# EAGLE schematic Motor Ouptut (EAGLE 6.5.0)
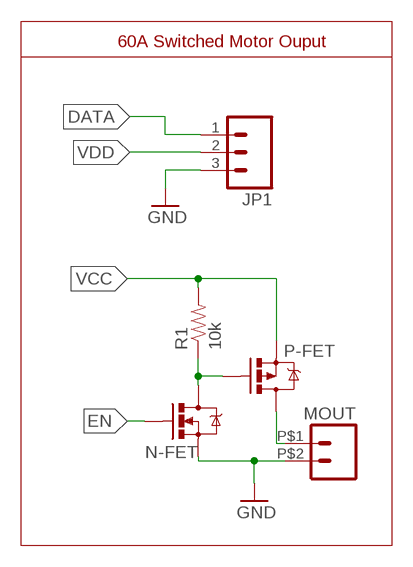
[diagram p0: schematic, sheet 1]

## Parts
JP1  M03PTH  [1X03]
MOUT  MINI_FIT_JR_5569  [MINI_FIT_JR]
N-FET  MOSFET-NCHANNELBSS138  [SOT23]
P-FET  MOSFET_P-CHANNEL  [POWERPAK_SO-8_SINGLE]
R1  10k  RESISTOR0603-RES  [0603-RES]

## Nets
DATA: JP1.1
EN: N-FET.1(G)
GND: JP1.3
N$1: MOUT.P$1 P-FET.P$5(D) P-FET.P$6(D) P-FET.P$7(D) P-FET.P$8(D)
N$2: N-FET.3(D) P-FET.P$4(G) R1.1
N$3: MOUT.P$2 N-FET.2(S)
VCC: P-FET.P$1(S) P-FET.P$2(S) P-FET.P$3(S) R1.2
VDD: JP1.2

## Notes on the sheet
- 60A Switched Motor Ouput

## Library data of the parts
JP1 = SparkFun-Connectors:M03: Header 3 Standard 3-pin 0.1" header. Use with straight break away headers (SKU : PRT-00116), right angle break away headers (PRT-00553), swiss pins (PRT-00743), machine pins (PRT-00117), and female headers (PRT-00115). Molex polarized connector foot print use with SKU : PRT-08232 with associated crimp pins and housings.; DIGIKEY: 952-2264-ND
MOUT = SAUVE:MINI_FIT_JR_5569
N-FET = SparkFun-DiscreteSemi:MOSFET-NCHANNEL: Common NMOSFET Parts MFG P/N Store ID Prod ID FDD8780 TRANS-09984 SI7820DN TRANS-11055 FDS6630A IC-08089 2N7002PW TRANS-11151 FQP30N06L COM-10213 TRANS-10060 BSS123LT1G TRANS-08345 BSS138 TRANS-00830 BS170 2N7000; DIGIKEY: BSS138KCT-ND; PROD_ID: TRANS-00830
P-FET = SAUVE:MOSFET_P-CHANNEL; DIGIKEY: SI7135DP-T1-GE3CT-ND
R1 = SparkFun-Resistors:RESISTOR: Resistor Basic schematic elements and footprints for 0603, 1206, and PTH resistors.; DIGIKEY: RMCF0603JT10K0CT-ND